# EAGLE design TX (EAGLE 9.5.0)
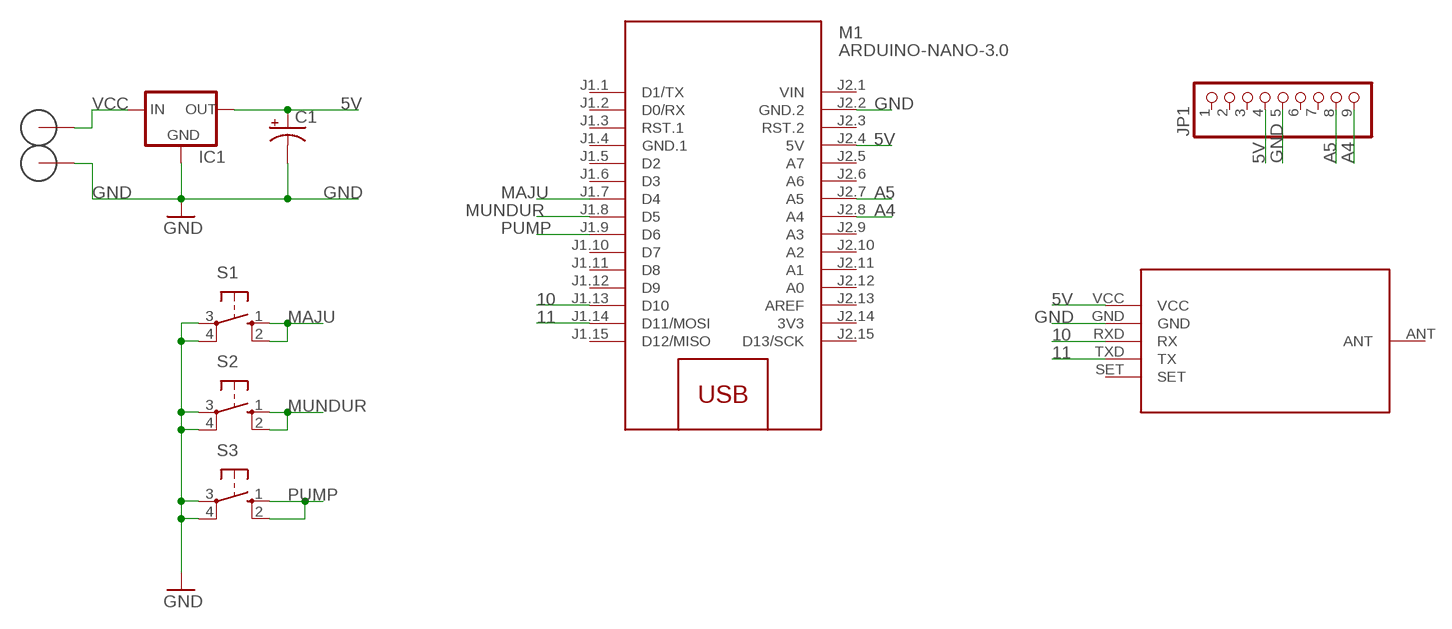
[diagram p0: schematic, sheet 1]

## Parts
C1  CPOL-USE2.5-7  [E2,5-7]
H1  3MM_HOLE  [3MM_HOLE]
H2  3MM_HOLE  [3MM_HOLE]
IC1  78XXS  [78XXS]
JP1  PINHD-1X9  [1X09]
M1  ARDUINO-NANO-3.0  [ARDUINO-NANO-3.0]
S1  10-XX  [B3F-10XX]
S2  10-XX  [B3F-10XX]
S3  10-XX  [B3F-10XX]
U$1  HC-12_FOOTPRINT  [HC-12_FOOTPRINT]

## Nets
5V: C1.+ IC1.OUT JP1.4 M1.J2.4(5V) U$1.VCC
10: M1.J1.13(D10) U$1.RXD(RX)
11: M1.J1.14(D11/MOSI) U$1.TXD(TX)
A4: JP1.9 M1.J2.8(A4)
A5: JP1.8 M1.J2.7(A5)
GND: C1.- H2.P$1(GND) H2.P$2(GND) H2.P$3(GND) H2.P$4(GND) H2.P$5(GND) H2.P$6(GND) H2.P$7(GND) H2.P$8(GND) H2.P$9(GND) IC1.GND JP1.5 M1.J2.2(GND.2) S1.3(P) S1.4(P1) S2.3(P) S2.4(P1) S3.3(P) S3.4(P1) U$1.GND
MAJU: M1.J1.7(D4) S1.1(S) S1.2(S1)
MUNDUR: M1.J1.8(D5) S2.1(S) S2.2(S1)
PUMP: M1.J1.9(D6) S3.1(S) S3.2(S1)
VCC: H1.P$1(GND) H1.P$2(GND) H1.P$3(GND) H1.P$4(GND) H1.P$5(GND) H1.P$6(GND) H1.P$7(GND) H1.P$8(GND) H1.P$9(GND) IC1.IN
Unconnected: JP1.1 JP1.2 JP1.3 JP1.6 JP1.7 M1.J1.1(D1/TX) M1.J1.2(D0/RX) M1.J1.3(RST.1) M1.J1.5(D2) M1.J1.6(D3) M1.J1.10(D7) M1.J1.11(D8) M1.J1.12(D9) M1.J1.15(D12/MISO) M1.J2.3(RST.2) M1.J2.5(A7) M1.J2.6(A6) M1.J2.9(A3) M1.J2.10(A2) M1.J2.11(A1) M1.J2.12(A0) M1.J2.13(AREF) M1.J2.15(D13/SCK) U$1.ANT U$1.SET

## Power pins joined to a net without a drawn wire
3V3: M1.J2.14(3V3)
GND.1: M1.J1.4(GND.1)
VIN: M1.J2.1(VIN)

## Library data of the parts
C1 = rcl:CPOL-US: POLARIZED CAPACITOR, American symbol; SPICEPREFIX: C
H1 H2 = 3mm_special_hole:3MM_HOLE: Cool looking 3mm hole with ground connection
IC1 = v-reg:78XXS: VOLTAGE REGULATOR
JP1 = pinhead:PINHD-1X9: PIN HEADER
M1 = diy-modules:ARDUINO-NANO-3.0: Arduino Nano 3.0 and compatible devices More details available here: https://www.arduino.cc/en/Main/ArduinoBoardNano Click here to find device on ebay.com <http://www.ebay.com/sch/arduino+nano>
S1-S3 = switch-omron:10-XX: OMRON SWITCH; MPN: B3F-1000; OC_FARNELL: 176432; OC_NEWARK: 36M3542
U$1 = hc12_433mhz:HC-12_FOOTPRINT: HC-12 433MHz module footprint MCHFIX is for mechanical fix pin which is NC but on this file connected to GND https://github.com/meendiz/hc-12_si4463/

## Board
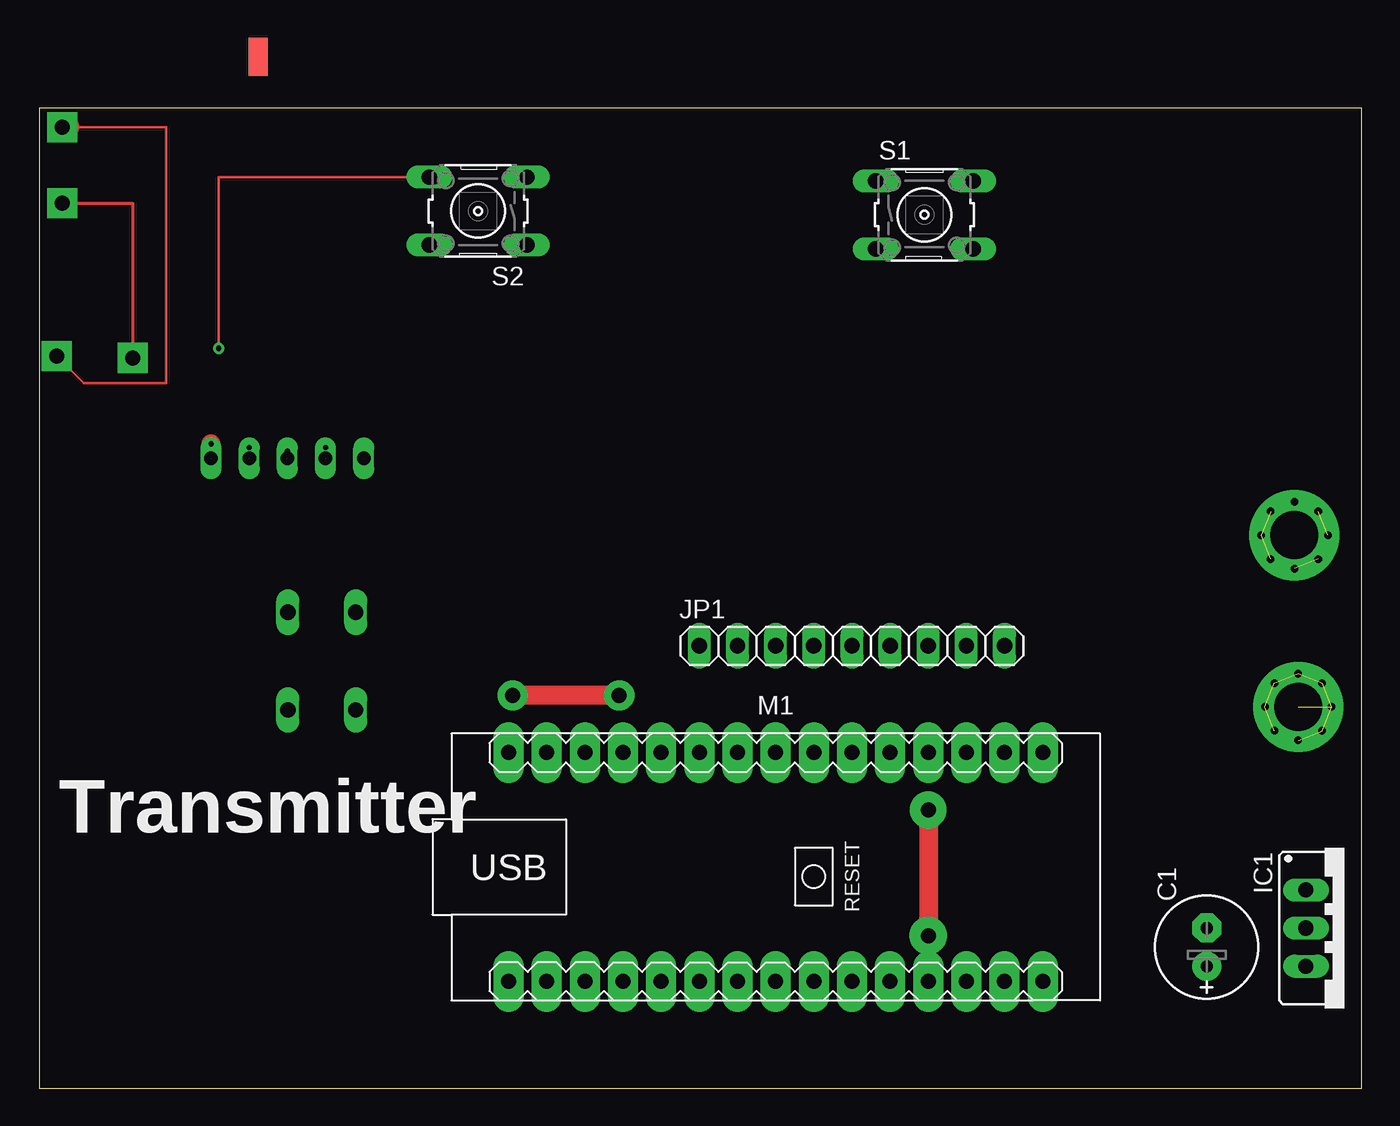
[diagram p1: board, top side]
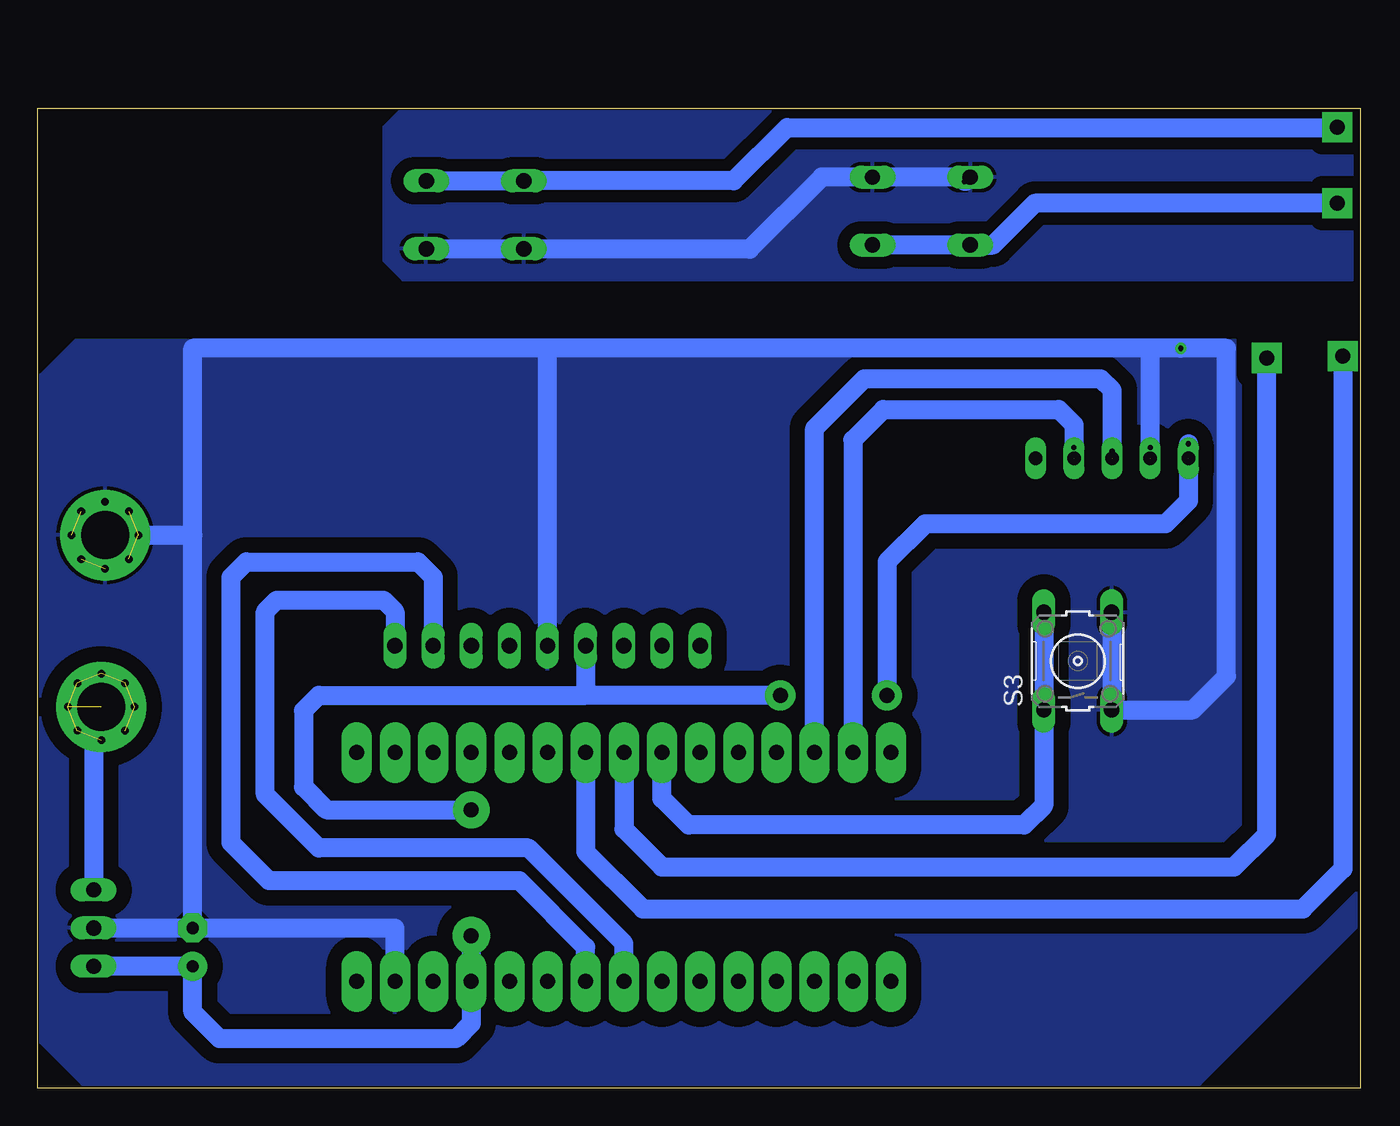
[diagram p2: board, bottom side, seen from below]

Size 88.06 x 65.27 mm. Coordinates in mm from the lower left corner, seen from the top.
Outline: 0,0 88.06,0 88.06,65.27 0,65.27 0,0
Copper layers (1*16): Top 0.035mm / dielectric 1.5mm / Bottom 0.035mm
Design rules "default *": minimum track width 6mil, minimum drill 0.35mm, track to track 24mil, track to pad 24mil, pad to pad 24mil, via to via 24mil, smd to smd 24mil, copper to edge 0mil, drill to drill 6mil, minimum pad ring 10mil, minimum via ring 8mil, stop-mask expansion 4mil, vias tented up to drill 0mil, thermal gap 10mil

### Footprints (pad centres in the part's own frame; a part is rotated, then mirrored left to right if it is on the bottom)
E2,5-7 = drill 0.813 pad 1.93: + -1.27,0 | drill 0.813 pad 1.93 octagon: - 1.27,0
3MM_HOLE = drill 3.2 pad 6: P$1 0,0 | drill 0.5 pad 0.61: P$2 0,2.223; P$3 0,-2.223; P$4 2.223,0; P$5 -2.223,0; P$6 -1.587,1.587; P$7 1.587,1.587; P$8 1.587,-1.587; P$9 -1.587,-1.587
78XXS = drill 1.016 long: GND 0,-2.54; IN -2.54,-2.54; OUT 2.54,-2.54
1X09 = drill 1.016 long: 1 -10.16,0; 2 -7.62,0; 3 -5.08,0; 4 -2.54,0; 5 0,0; 6 2.54,0; 7 5.08,0; 8 7.62,0; 9 10.16,0
ARDUINO-NANO-3.0 = drill 1 pad 2.032 long: J1.1 17.78,7.62; J1.2 15.24,7.62; J1.3 12.7,7.62; J1.4 10.16,7.62; J1.5 7.62,7.62; J1.6 5.08,7.62; J1.7 2.54,7.62; J1.8 0,7.62; J1.9 -2.54,7.62; J1.10 -5.08,7.62; J1.11 -7.62,7.62; J1.12 -10.16,7.62; J1.13 -12.7,7.62; J1.14 -15.24,7.62; J1.15 -17.78,7.62; J2.1 17.78,-7.62; J2.2 15.24,-7.62; J2.3 12.7,-7.62; J2.4 10.16,-7.62; J2.5 7.62,-7.62; J2.6 5.08,-7.62; J2.7 2.54,-7.62; J2.8 0,-7.62; J2.9 -2.54,-7.62; J2.10 -5.08,-7.62; J2.11 -7.62,-7.62; J2.12 -10.16,-7.62; J2.13 -12.7,-7.62; J2.14 -15.24,-7.62; J2.15 -17.78,-7.62
B3F-10XX = drill 1.016 long: 1 -3.251,2.261; 2 3.251,2.261; 3 -3.251,-2.261; 4 3.251,-2.261
HC-12_FOOTPRINT = smd 2.54 x 1.27: ANT 25.49,7.03 | smd 0.406 x 0.203 bottom: GND -1.27,7.62; RXD -1.27,5.08; SET -1.27,0; TXD -1.27,2.54 | drill 0.9 pad 1.27 long: P$1 -1.27,10.16; P$2 -1.27,7.62; P$3 -1.27,5.08; P$4 -1.27,2.54; P$5 -1.27,0 | smd 0.305 x 0.152 bottom: VCC -1.27,10.16

### Placement (x,y rotation side)
C1  77.72,9.4 90 top
H1  83.82,25.4 270 top
H2  83.57,36.83 0 top
IC1  86.87,10.67 270 top
JP1  54.1,29.46 0 top
M1  49.02,14.73 0 top
S1  58.93,58.17 0 top
S2  29.21,58.42 180 top
S3  18.8,28.45 90 bottom
U$1  21.59,43.21 90 top

### Tracks (layer width: path | path; a pad name or v marks a point on that pad's centre or on a via)
5V  (via drill 0.35, 1 pad 2, 1 pad 2.45, 1 pad 2.5)  (1 unrouted)
  Top 1.27: U$1.VCC v11.43,42.93 | v59.18,18.54 v59.18,10.16 | v38.61,26.16 v31.5,26.16
  Bottom 1.27: JP1.4 51.56,26.16 | v59.18,18.54 68.83,18.54 70.36,20.07 70.36,25.15 69.34,26.16 51.56,26.16 | v59.18,10.16 M1.J2.4 59.18,4.32 60.2,3.3 75.95,3.3 77.72,5.08 C1.+ IC1.OUT | v11.43,42.93 11.43,39.12 12.95,37.59 28.96,37.59 31.5,35.05 v31.5,26.16 | v38.61,26.16 51.56,26.16
10  (via drill 0.35)  (1 unrouted)
  Top 1.27: U$1.RXD v16.51,42.42
  Bottom 1.27: M1.J1.13 36.32,43.94 33.02,47.24 17.27,47.24 16.51,46.48 v16.51,42.42
11  (via drill 0.35)  (1 unrouted)
  Top 1.27: U$1.TXD v19.05,42.67
  Bottom 1.27: v19.05,42.67 19.05,44.2 20.07,45.21 31.75,45.21 33.78,43.18 M1.J1.14
A4
  Bottom 1.27: M1.J2.8 49.02,9.65 55.37,16 69.34,16 72.9,19.56 72.9,31.75 72.14,32.51 65.02,32.51 64.26,31.75 JP1.9
A5
  Bottom 1.27: M1.J2.7 51.56,9.4 55.98,13.82 72.64,13.82 75.18,16.36 75.18,34.04 74.17,35.05 62.74,35.05 61.72,34.04 JP1.8
GND  (via drill 0.35)  (5 unrouted)
  Top 0.152: v11.94,49.28 11.94,60.68 S2.4
  Top 1.27: U$1.GND v13.97,42.67
  Bottom 1.27: IC1.GND C1.- | M1.J2.2 64.26,10.67 C1.- | v13.97,42.67 13.97,49.28 | 13.97,49.28 53.85,49.28 | 53.85,49.28 77.72,49.28 77.72,36.83 | C1.- 77.72,36.83 | JP1.5 54.1,49.02 53.85,49.28 | 13.97,49.28 v11.94,49.28 8.89,49.28 8.89,27.43 11.12,25.2 S3.3 S3.4 | S1.4 S1.3 55.65,55.88 40.64,55.88 35.84,60.68 S2.3 S2.4 26.26,60.38 v26.34,60.38 | H2.P$1 77.72,36.83
  pour Bottom (isolate 1.016): 0.25,49.78 85.6,49.78 87.88,47.5 87.88,3.05 85.09,0.25 10.67,0.25 0.25,10.67
  pour Bottom (isolate 0.813): 0.51,65.02 64.01,65.02 65.02,64.01 65.02,55.12 63.75,53.85 0.51,53.85
MAJU  (via drill 1 pad 2)
  Top 0.152: 2.03,64.01 8.43,64.01 8.43,46.95 2.96,46.95 v1.14,48.77
  Top 1.27: 2.03,64.01 v1.52,64.01
  Bottom 1.27: M1.J1.7 51.56,15.75 47.75,11.94 3.81,11.94 1.14,14.61 v1.14,48.77 | S1.2 S1.1 41.71,60.43 38.15,63.98 1.55,63.98 v1.52,64.01
MUNDUR  (via drill 1 pad 2)
  Top 0.203: v1.52,58.93 6.22,58.93 v6.22,48.64
  Bottom 1.27: M1.J1.8 49.02,17.27 46.48,14.73 8.38,14.73 6.22,16.89 v6.22,48.64 | S2.1 S2.2 24.44,56.16 21.67,58.93 v1.52,58.93
PUMP
  Bottom 1.27: M1.J1.9 46.48,19.3 44.7,17.53 22.35,17.53 21.06,18.82 S3.1 S3.2
VCC  (8 unrouted)
  Bottom 1.27: IC1.IN 84.33,24.89 H1.P$1

### Text on the board
tPlace: Transmitter